# EAGLE design cafereg2 (EAGLE 9.6.1)

## Sheet 1 of 6: SiC431 1V 20A
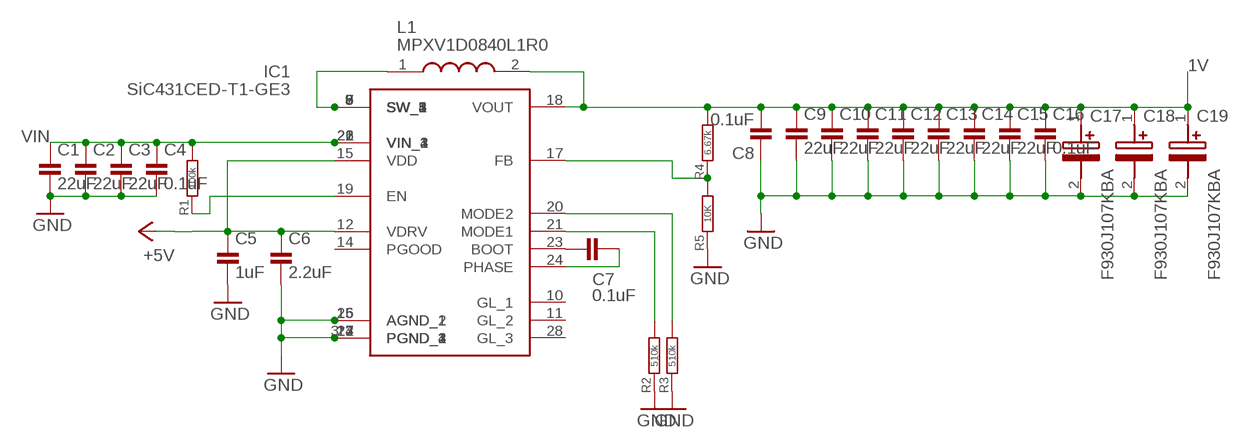
[diagram p0: schematic, sheet 1]

### Parts
C1  22uF  C-USC0603  [C0603]
C2  22uF  C-USC0603  [C0603]
C3  22uF  C-USC0603  [C0603]
C4  0.1uF  C-USC0402  [C0402]
C5  1uF  C-USC0402  [C0402]
C6  2.2uF  C-USC0402  [C0402]
C7  0.1uF  C-USC0402  [C0402]
C8  0.1uF  C-USC0402  [C0402]
C9  22uF  C-USC0603  [C0603]
C10  22uF  C-USC0603  [C0603]
C11  22uF  C-USC0603  [C0603]
C12  22uF  C-USC0603  [C0603]
C13  22uF  C-USC0603  [C0603]
C14  22uF  C-USC0603  [C0603]
C15  22uF  C-USC0603  [C0603]
C16  0.1uF  C-USC0402  [C0402]
C17  F930J107KBA  [CAPPM3528X210N]
C18  F930J107KBA  [CAPPM3528X210N]
C19  F930J107KBA  [CAPPM3528X210N]
IC1  SiC431CED-T1-GE3  SIC431AED-T1-GE3  [SIC431AEDT1GE3]
L1  MPXV1D0840L1R0  [INDPM8680X400N]
R1  100k  R-US_R0402  [R0402]
R2  510k  R-US_R0402  [R0402]
R3  510k  R-US_R0402  [R0402]
R4  6.67k  R-US_R0402  [R0402]
R5  10K  R-US_R0402  [R0402]

### Nets
1V: C8.2 C9.1 C10.1 C11.1 C12.1 C13.1 C14.1 C15.1 C16.1 C17.1(+) C18.1(+) C19.1(+) IC1.18(VOUT) L1.2 R4.2
+5V: C5.1 C6.1 IC1.12(VDRV) IC1.15(VDD) ; also sheet 2,6
BOOT: C7.1 IC1.23(BOOT)
FB: IC1.17(FB) R4.1 R5.2
GND: C1.2 C2.2 C3.2 C4.2 C5.2 C6.2 C8.1 C9.2 C10.2 C11.2 C12.2 C13.2 C14.2 C15.2 C16.2 C17.2(-) C18.2(-) C19.2(-) IC1.3(PGND_1) IC1.4(PGND_2) IC1.13(PGND_3) IC1.16(AGND_1) IC1.25(AGND_2) IC1.27(PGND_4) IC1.29(PGND_1) R2.1 R3.1 R5.1 ; also sheet 2,3,4,5,6
N$5: IC1.19(EN) R1.1
N$6: IC1.21(MODE1) R2.2
N$7: IC1.5(SW_1) IC1.6(SW_2) IC1.7(SW_3) IC1.8(SW_4) IC1.9(SW_5) L1.1
N$8: IC1.20(MODE2) R3.2
PHASE: C7.2 IC1.24(PHASE)
VIN: C1.1 C2.1 C3.1 C4.1 IC1.1(VIN_1) IC1.2(VIN_2) IC1.22(VIN_3) IC1.26(VIN_4) R1.2 ; also sheet 2,3,4,5,6
Unconnected: IC1.10(GL_1) IC1.11(GL_2) IC1.14(PGOOD) IC1.28(GL_3)

## Sheet 2 of 6: SiC438 1.15V 8A
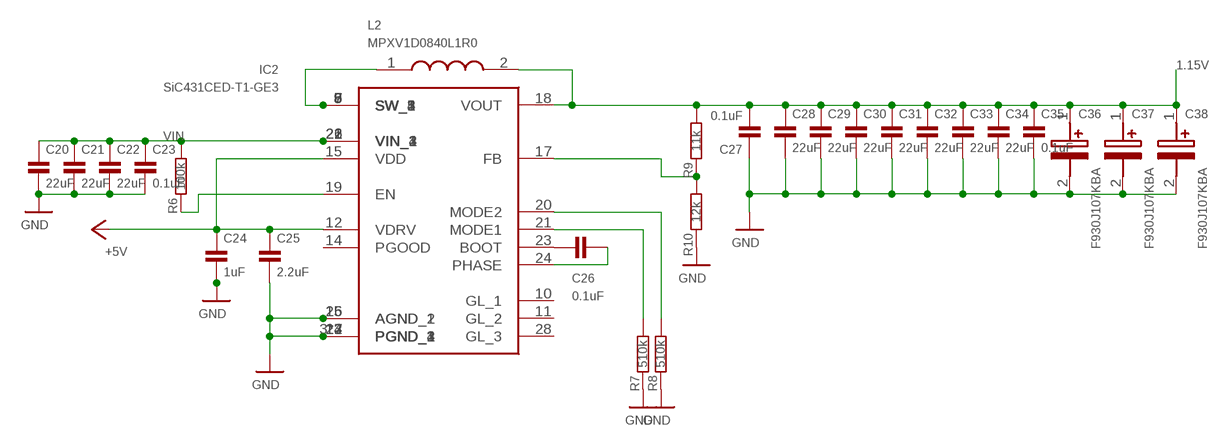
[diagram p1: schematic, sheet 2]

### Parts
C20  22uF  C-USC0603  [C0603]
C21  22uF  C-USC0603  [C0603]
C22  22uF  C-USC0603  [C0603]
C23  0.1uF  C-USC0402  [C0402]
C24  1uF  C-USC0402  [C0402]
C25  2.2uF  C-USC0402  [C0402]
C26  0.1uF  C-USC0402  [C0402]
C27  0.1uF  C-USC0402  [C0402]
C28  22uF  C-USC0603  [C0603]
C29  22uF  C-USC0603  [C0603]
C30  22uF  C-USC0603  [C0603]
C31  22uF  C-USC0603  [C0603]
C32  22uF  C-USC0603  [C0603]
C33  22uF  C-USC0603  [C0603]
C34  22uF  C-USC0603  [C0603]
C35  0.1uF  C-USC0402  [C0402]
C36  F930J107KBA  [CAPPM3528X210N]
C37  F930J107KBA  [CAPPM3528X210N]
C38  F930J107KBA  [CAPPM3528X210N]
IC2  SiC431CED-T1-GE3  SIC431AED-T1-GE3  [SIC431AEDT1GE3]
L2  MPXV1D0840L1R0  [INDPM8680X400N]
R6  100k  R-US_R0402  [R0402]
R7  510k  R-US_R0402  [R0402]
R8  510k  R-US_R0402  [R0402]
R9  11k  R-US_R0402  [R0402]
R10  12k  R-US_R0402  [R0402]

### Nets
1.15V: C27.2 C28.1 C29.1 C30.1 C31.1 C32.1 C33.1 C34.1 C35.1 C36.1(+) C37.1(+) C38.1(+) IC2.18(VOUT) L2.2 R9.2
+5V: C24.1 C25.1 IC2.12(VDRV) IC2.15(VDD) ; also sheet 1,6
BOOT2: C26.1 IC2.23(BOOT)
FB2: IC2.17(FB) R9.1 R10.2
GND: C20.2 C21.2 C22.2 C23.2 C24.2 C25.2 C27.1 C28.2 C29.2 C30.2 C31.2 C32.2 C33.2 C34.2 C35.2 C36.2(-) C37.2(-) C38.2(-) IC2.3(PGND_1) IC2.4(PGND_2) IC2.13(PGND_3) IC2.16(AGND_1) IC2.25(AGND_2) IC2.27(PGND_4) IC2.29(PGND_1) R7.1 R8.1 R10.1 ; also sheet 1,3,4,5,6
N$12: IC2.19(EN) R6.1
N$13: IC2.5(SW_1) IC2.6(SW_2) IC2.7(SW_3) IC2.8(SW_4) IC2.9(SW_5) L2.1
N$14: IC2.21(MODE1) R7.2
N$15: IC2.20(MODE2) R8.2
PHASE2: C26.2 IC2.24(PHASE)
VIN: C20.1 C21.1 C22.1 C23.1 IC2.1(VIN_1) IC2.2(VIN_2) IC2.22(VIN_3) IC2.26(VIN_4) R6.2 ; also sheet 1,3,4,5,6
Unconnected: IC2.10(GL_1) IC2.11(GL_2) IC2.14(PGOOD) IC2.28(GL_3)

## Sheet 3 of 6: TPS63810 3.3V 2.5A
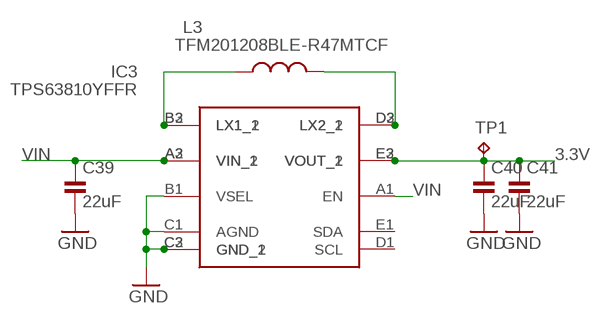
[diagram p2: schematic, sheet 3]

### Parts
C39  22uF  C-USC0603  [C0603]
C40  22uF  C-USC0603  [C0603]
C41  22uF  C-USC0603  [C0603]
IC3  TPS63810YFFR  [BGA15C40P3X5_134X226X62]
L3  TFM201208BLE-R47MTCF  L_CHIP-0805(2012-METRIC)  [INDC2009X120]
TP1  TPTP12SQ  [TP12SQ]

### Nets
3.3V: C40.1 C41.1 IC3.E2(VOUT_1) IC3.E3(VOUT_2) TP1.TP
GND: C39.2 C40.2 C41.2 IC3.B1(VSEL) IC3.C1(AGND) IC3.C2(GND_1) IC3.C3(GND_2) ; also sheet 1,2,4,5,6
SW1: IC3.B2(LX1_1) IC3.B3(LX1_2) L3.1
SW2: IC3.D2(LX2_1) IC3.D3(LX2_2) L3.2
VIN: C39.1 IC3.A1(EN) IC3.A2(VIN_1) IC3.A3(VIN_2) ; also sheet 1,2,4,5,6
Unconnected: IC3.D1(SCL) IC3.E1(SDA)

## Sheet 4 of 6: MUN3CAD03-SE 1.5V 3A
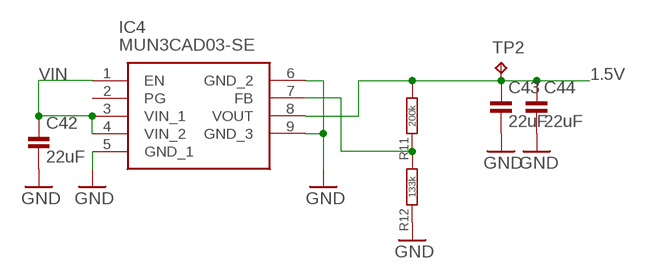
[diagram p3: schematic, sheet 4]

### Parts
C42  22uF  C-USC0603  [C0603]
C43  22uF  C-USC0603  [C0603]
C44  22uF  C-USC0603  [C0603]
IC4  MUN3CAD03-SE  [MUN3CAD03SE]
R11  200k  R-US_R0402  [R0402]
R12  133k  R-US_R0402  [R0402]
TP2  TPTP12SQ  [TP12SQ]

### Nets
1.5V: C43.1 C44.1 IC4.8(VOUT) R11.2 TP2.TP
FB1: IC4.7(FB) R11.1 R12.2
GND: C42.2 C43.2 C44.2 IC4.5(GND_1) IC4.6(GND_2) IC4.9(GND_3) R12.1 ; also sheet 1,2,3,5,6
VIN: C42.1 IC4.1(EN) IC4.3(VIN_1) IC4.4(VIN_2) ; also sheet 1,2,3,5,6
Unconnected: IC4.2(PG)

## Sheet 5 of 6: MUN3CAD01-SB 1.1/1.25V 1A
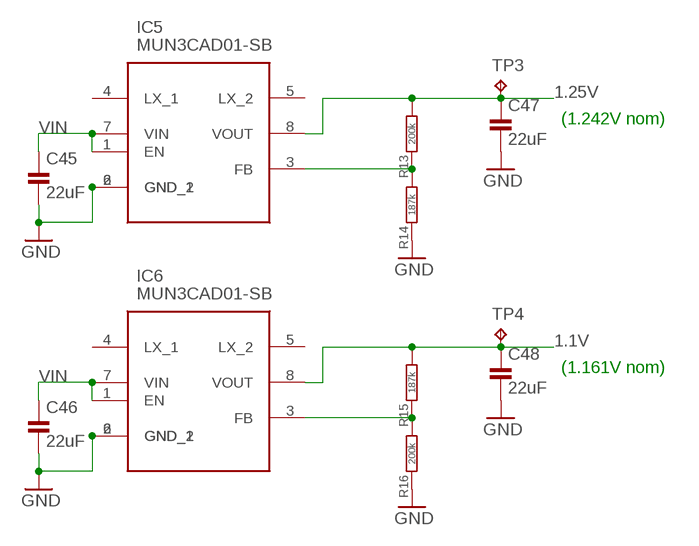
[diagram p4: schematic, sheet 5]

### Parts
C45  22uF  C-USC0603  [C0603]
C46  22uF  C-USC0603  [C0603]
C47  22uF  C-USC0603  [C0603]
C48  22uF  C-USC0603  [C0603]
IC5  MUN3CAD01-SB  [MUN3CAD01SB]
IC6  MUN3CAD01-SB  [MUN3CAD01SB]
R13  200k  R-US_R0402  [R0402]
R14  187k  R-US_R0402  [R0402]
R15  187k  R-US_R0402  [R0402]
R16  200k  R-US_R0402  [R0402]
TP3  TPTP12SQ  [TP12SQ]
TP4  TPTP12SQ  [TP12SQ]

### Nets
1.1V: C48.1 IC6.8(VOUT) R15.2 TP4.TP
1.25V: C47.1 IC5.8(VOUT) R13.2 TP3.TP
GND: C45.2 C46.2 C47.2 C48.2 IC5.2(GND_1) IC5.6(GND_2) IC6.2(GND_1) IC6.6(GND_2) R14.1 R16.1 ; also sheet 1,2,3,4,6
N$1: IC6.3(FB) R15.1 R16.2
N$2: IC5.3(FB) R13.1 R14.2
VIN: C45.1 C46.1 IC5.1(EN) IC5.7(VIN) IC6.1(EN) IC6.7(VIN) ; also sheet 1,2,3,4,6
Unconnected: IC5.4(LX_1) IC5.5(LX_2) IC6.4(LX_1) IC6.5(LX_2)

### Notes on the sheet
- (1.242V nom)
- (1.161V nom)

## Sheet 6 of 6: KTC2210 5V 1A
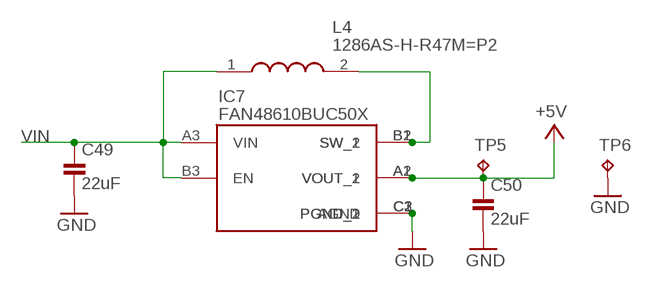
[diagram p5: schematic, sheet 6]

### Parts
C49  22uF  C-USC0603  [C0603]
C50  22uF  C-USC0603  [C0603]
IC7  FAN48610BUC50X  [BGA9C40P3X3_122X122X62]
L4  1286AS-H-R47M=P2  [1286ASH1R0MP2]
TP5  TPTP12SQ  [TP12SQ]
TP6  TPTP12SQ  [TP12SQ]

### Nets
+5V: C50.1 IC7.A1(VOUT_1) IC7.A2(VOUT_2) TP5.TP ; also sheet 1,2
GND: C49.2 C50.2 IC7.C1(PGND_1) IC7.C2(PGND_2) IC7.C3(AGND) TP6.TP ; also sheet 1,2,3,4,5
SW: IC7.B1(SW_1) IC7.B2(SW_2) L4.2
VIN: C49.1 IC7.A3(VIN) IC7.B3(EN) L4.1 ; also sheet 1,2,3,4,5

## Library data of the parts
C1-C16 C20-C35 C39-C50 = resistor:C-US: CAPACITOR, American symbol
C17-C19 C36-C38 = SamacSys_Parts:F930J107KBA: AVX 100uF 6.3 V Tantalum Capacitor Electrolytic Solid F93 Series Source: Datasheet <http://datasheets.avx.com/F93.pdf>; DESCRIPTION: AVX 100uF 6.3 V Tantalum Capacitor Electrolytic Solid F93 Series; HEIGHT: 2.1mm; MANUFACTURER_NAME: AVX; MANUFACTURER_PART_NUMBER: F930J107KBA; MOUSER_PART_NUMBER: 647-F930J107KBA; MOUSER_PRICE-STOCK: https://www.mouser.co.uk/ProductDetail/AVX/F930J107KBA/?qs=a5AWWN0nKwZJCzViS%2FKXGw%3D%3D
IC1 IC2 = personal:SIC431AED-T1-GE3: Switching Voltage Regulators 4.5-24V 24A 50uA microBUCK MLP44-24 Source: Datasheet; DESCRIPTION: Switching Voltage Regulators 4.5-24V 24A 50uA microBUCK MLP44-24; HEIGHT: mm; MANUFACTURER_NAME: Vishay; MANUFACTURER_PART_NUMBER: SiC431AED-T1-GE3; MOUSER_PART_NUMBER: 78-SIC431AED-T1-GE3; MOUSER_PRICE-STOCK: https://www.mouser.co.uk/ProductDetail/Vishay-Siliconix/SIC431AED-T1-GE3?qs=chTDxNqvsynTWHIPRmLWxw%3D%3D
IC3 = SamacSys_Parts:TPS63810YFFR: Switching Voltage Regulators 2.5-A high-efficient buck-boost converter with interface for dynamic voltage scaling 15-DSBGA -40 to 85 Source: Datasheet <http://www.ti.com/lit/ds/symlink/tps63810.pdf>; DESCRIPTION: Switching Voltage Regulators 2.5-A high-efficient buck-boost converter with interface for dynamic voltage scaling 15-DSBGA -40 to 85; HEIGHT: 0.625mm; MANUFACTURER_NAME: Texas Instruments; MANUFACTURER_PART_NUMBER: TPS63810YFFR; MOUSER_PART_NUMBER: 595-TPS63810YFFR; MOUSER_PRICE-STOCK: https://www.mouser.co.uk/ProductDetail/Texas-Instruments/TPS63810YFFR?qs=B6kkDfuK7%2FBxO%252BN9P7Asyw%3D%3D
IC4 = SamacSys_Parts:MUN3CAD03-SE: Non-Isolated DC/DC Converters 3A 5Vin inductor-integrated DC-DC converters Source: Datasheet; DESCRIPTION: Non-Isolated DC/DC Converters 3A 5Vin inductor-integrated DC-DC converters; HEIGHT: 1.3mm; MANUFACTURER_NAME: Delta Electronics; MANUFACTURER_PART_NUMBER: MUN3CAD03-SE; MOUSER_PART_NUMBER: 108-MUN3CAD03-SE; MOUSER_PRICE-STOCK: https://www.mouser.co.uk/ProductDetail/Delta-Electronics/MUN3CAD03-SE?qs=t7xnP681wgWoX6LfHO%2FvWw%3D%3D
IC5 IC6 = SamacSys_Parts:MUN3CAD01-SB: 1.0A Output Current 92% Peak Efficiency at 3.3VIN Input Voltage Range from 2.5V to 5.5V Output Voltage Range from 0.8V to 4.0V(2.5mm 2.0mm x 1.1mm(max)) Enable Function Source: Datasheet <https://www.cyntec.com/upfile/products/download/Cyntec MUN3CAD01-SB_Datasheet 06.pdf>; DESCRIPTION: 1.0A Output Current 92% Peak Efficiency at 3.3VIN Input Voltage Range from 2.5V to 5.5V Output Voltage Range from 0.8V to 4.0V(2.5mm 2.0mm x 1.1mm(max)) Enable Function; HEIGHT: 1.1mm; MANUFACTURER_NAME: Cyntec; MANUFACTURER_PART_NUMBER: MUN3CAD01-SB
IC7 = SamacSys_Parts:FAN48610BUC50X: Fairchild Semiconductor FAN48610BUC50X, Boost Converter, Synchronous Boost Regulator 1000mA Maximum of 5 V, 3 MHz Source: Datasheet <https://datasheet.datasheetarchive.com/originals/distributors/Datasheets_SAMA/df3e85b90ab3bcbb613a20fbddbf2a27.pdf>; DESCRIPTION: Fairchild Semiconductor FAN48610BUC50X, Boost Converter, Synchronous Boost Regulator 1000mA Maximum of 5 V, 3 MHz; HEIGHT: 0.619mm; MANUFACTURER_NAME: onsemi; MANUFACTURER_PART_NUMBER: FAN48610BUC50X; MOUSER_PART_NUMBER: 512-FAN48610BUC50X; MOUSER_PRICE-STOCK: https://www.mouser.co.uk/ProductDetail/onsemi-Fairchild/FAN48610BUC50X?qs=3SGS%2FGl3GGxq8QpgJZs7Nw%3D%3D
L1 L2 = SamacSys_Parts:MPXV1D0840L1R0: KEMET, MPXV, Power, 1 uH, 20%, 155C, -55C, 0840(3431), 20.8 A, 4.2 mOhms, 40 MHz, 1000, 8.65mm, 8.9mm, 8mm, 8.2mm, 4mm, 4mm Source: Datasheet <https://content.kemet.com/datasheets/KEM_L9013_MPXV.pdf>; DESCRIPTION: KEMET, MPXV, Power, 1 uH, 20%, 155C, -55C, 0840(3431), 20.8 A, 4.2 mOhms, 40 MHz, 1000, 8.65mm, 8.9mm, 8mm, 8.2mm, 4mm, 4mm; HEIGHT: 4mm; MANUFACTURER_NAME: KEMET; MANUFACTURER_PART_NUMBER: MPXV1D0840L1R0
L3 = Inductor:L: Inductor Fixed - Generic; CATEGORY: Inductor; SUB-CATEGORY: Fixed
L4 = SamacSys_Parts:1286AS-H-R47M=P2: Toko DFE201612C Series Shielded Wire-wound SMD Inductor with a Powered Iron Core, 470 nH Wire-Wound 4.2A Idc Source: Datasheet <https://psearch.en.murata.com/inductor/product/1286AS-H-R47M#.html>; DESCRIPTION: Toko DFE201612C Series Shielded Wire-wound SMD Inductor with a Powered Iron Core, 470 nH Wire-Wound 4.2A Idc; HEIGHT: 1.2mm; MANUFACTURER_NAME: Murata Electronics; MANUFACTURER_PART_NUMBER: 1286AS-H-R47M=P2; MOUSER_PART_NUMBER: 81-1286AS-H-R47MP2; MOUSER_PRICE-STOCK: https://www.mouser.co.uk/ProductDetail/Murata-Electronics/1286AS-H-R47M%3dP2?qs=KuGPmAKtFKWcPKeH5oNBbA%3D%3D
R1-R16 = resistor:R-US_: RESISTOR, American symbol
TP1-TP6 = testpad:TP: Test pad

## Board
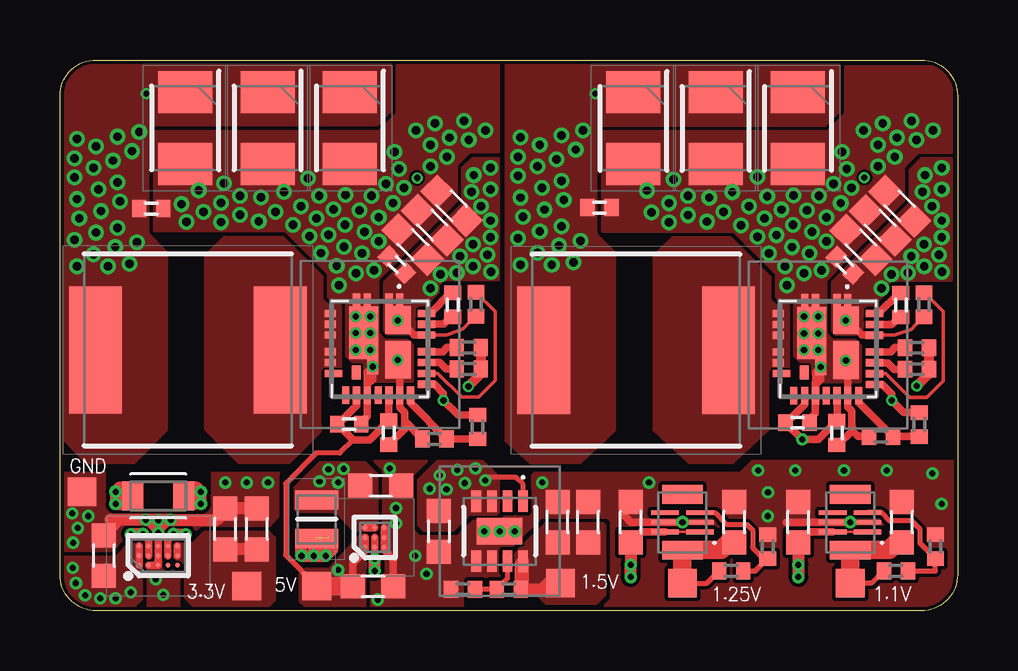
[diagram p6: board, top side]
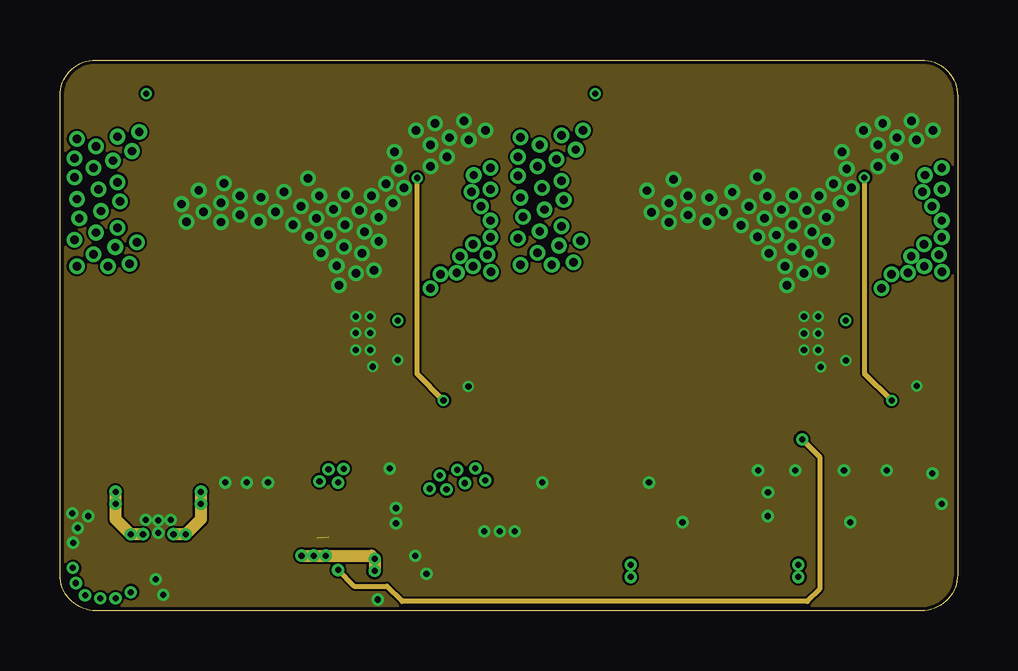
[diagram p7: board, inner layer Route2]
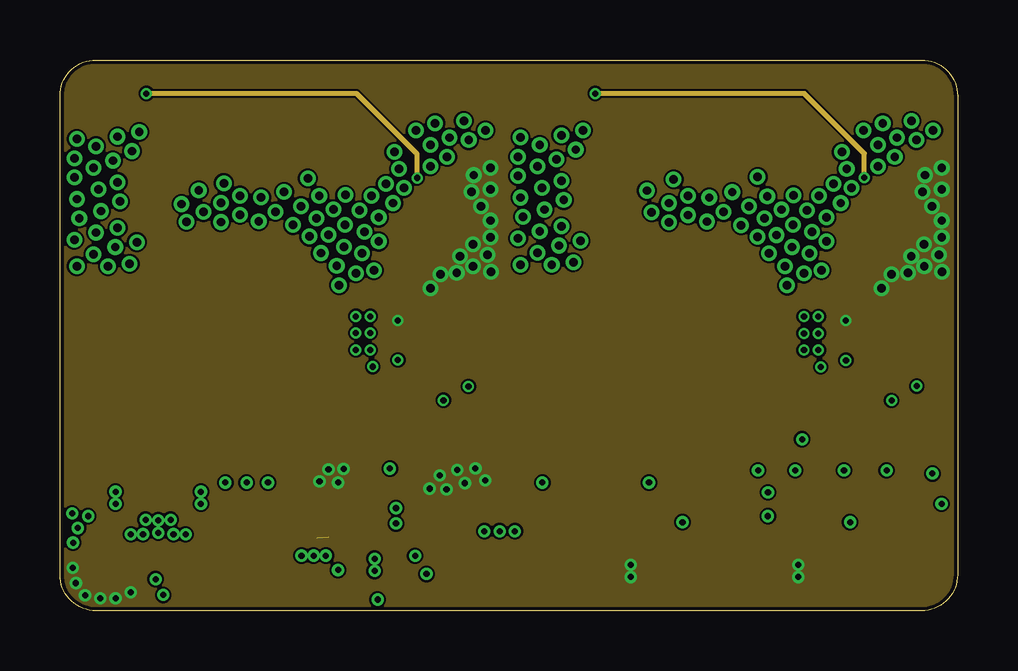
[diagram p8: board, inner layer Route15]
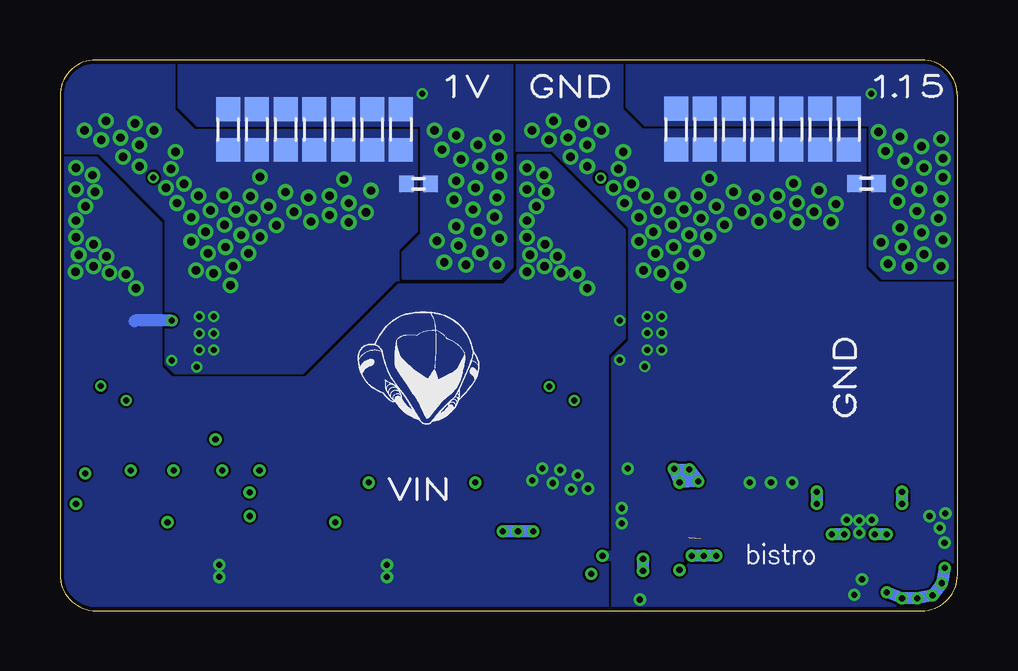
[diagram p9: board, bottom side, seen from below]

Size 37.4 x 22.96 mm. Coordinates in mm from the lower left corner, seen from the top.
Outline: 1.5,22.96 35.9,22.96 arc-90 37.4,21.46 37.4,1.5 arc-90 35.9,0 1.5,0 arc-90 0,1.5 0,21.46 arc-90 1.5,22.96
Copper layers (1+2*15+16): Top 0.035mm / dielectric 0.2mm / Route2 0.035mm / dielectric 0.26mm / Route15 0.035mm / dielectric 0.2mm / Bottom 0.035mm
Design rules "default *": minimum track width 5mil, minimum drill 10mil, track to track 3.5mil, track to pad 3.5mil, pad to pad 3.5mil, via to via 3.5mil, smd to smd 0mil, copper to edge 6mil, drill to drill 6mil, minimum pad ring 4mil, minimum via ring 4mil, stop-mask expansion 1mil, vias tented up to drill 200mil, thermal gap 10mil
tRestrict: area 3.5,4.2 to 4.7,5.9; 9 lines

### Footprints (pad centres in the part's own frame; a part is rotated, then mirrored left to right if it is on the bottom)
C0603 = smd 1 x 1: 1 -0.85,0; 2 0.85,0
C0402 = smd 0.6 x 0.7: 1 -0.5,0; 2 0.5,0
CAPPM3528X210N = smd 1.75 x 2.25: 1 -1.5,0; 2 1.5,0
SIC431AEDT1GE3 = smd 0.55 x 0.3: 1 -0.825,0.075; 2 -0.825,-0.375; 3 -0.825,-1.275; 4 -0.825,-1.725 | smd 0.3 x 0.45: 5 -0.275,-2.825; 6 0.175,-2.825; 7 0.625,-2.825; 8 1.325,-2.825; 9 1.775,-2.825 | smd 0.3 x 0.73: 10 2.225,-2.685; 18 2.678,1.187; 19 2.228,1.187; 20 1.777,1.187; 21 1.328,1.187; 22 0.627,1.187; 23 0.177,1.187; 24 -0.273,1.187 | smd 0.73 x 0.3: 11 3.14,-2.175; 12 3.14,-1.725; 13 3.14,-1.275; 14 3.14,-0.825; 15 3.14,-0.375; 16 3.14,0.075; 17 3.14,0.525 | smd 1.575 x 1.05: 25 1.662,0 | smd 1.15 x 1.05: 26 0,0 | smd 2.175 x 1.2: 27 0.537,-1.425 | smd 0.58 x 0.38: 28 2.185,-1.74 | smd 0.65 x 0.455: 29 1.95,-1.052
BGA15C40P3X5_134X226X62 = smd 0.2 x 0.2: A1 -0.4,0.8; A2 0,0.8; A3 0.4,0.8; B1 -0.4,0.4; B2 0,0.4; B3 0.4,0.4; C1 -0.4,0; C2 0,0; C3 0.4,0; D1 -0.4,-0.4; D2 0,-0.4; D3 0.4,-0.4; E1 -0.4,-0.8; E2 0,-0.8; E3 0.4,-0.8
MUN3CAD03SE = smd 0.9 x 0.4: 1 -1.25,0.975; 2 -1.25,0.325; 3 -1.25,-0.325; 4 -1.25,-0.975; 5 1.25,-0.975; 6 1.25,-0.325; 7 1.25,0.325; 8 1.25,0.975 | smd 1.1 x 1.9: 9 0,0
MUN3CAD01SB = smd 1.15 x 0.2: 1 -0.725,0.4; 2 -0.725,0; 3 -0.725,-0.4; 5 0.725,-0.4; 6 0.725,0; 7 0.725,0.4 | smd 1.7 x 0.78: 4 0,-1.16; 8 0,1.16
BGA9C40P3X3_122X122X62 = smd 0.208 x 0.208: A1 -0.4,0.4; A2 0,0.4; A3 0.4,0.4; B1 -0.4,0; B2 0,0; B3 0.4,0; C1 -0.4,-0.4; C2 0,-0.4; C3 0.4,-0.4
INDPM8680X400N = smd 2.2 x 5.3: 1 -3.85,0; 2 3.85,0
INDC2009X120 = smd 0.876 x 1.21: 1 -1.067,0; 2 1.067,0
1286ASH1R0MP2 = smd 0.8 x 1.8: 1 -0.8,0; 2 0.8,0
R0402 = smd 0.6 x 0.7: 1 -0.5,0; 2 0.5,0
TP12SQ = smd 1.2 x 1.2: TP 0,0

### Placement (x,y rotation side)
C1  34.99,16.88 135 top
C2  34.18,16.07 135 top
C3  33.37,15.26 135 top
C4  32.7,14.42 135 top
C5  32.37,7.41 270 top
C6  30.73,7.84 0 top
C7  35.04,12.75 90 top
C8  22.47,17.8 0 bottom
C9  24.4,20.07 270 bottom
C10  23.2,20.07 270 bottom
C11  25.6,20.07 270 bottom
C12  26.8,20.07 270 bottom
C13  28,20.07 270 bottom
C14  29.2,20.07 270 bottom
C15  30.4,20.07 270 bottom
C16  22.48,16.8 0 top
C17  23.89,20.11 270 top
C18  27.32,20.11 270 top
C19  30.75,20.11 270 top
C20  16.32,16.89 135 top
C21  15.51,16.08 135 top
C22  14.7,15.27 135 top
C23  14.03,14.43 135 top
C24  13.7,7.42 270 top
C25  12.05,7.78 0 top
C26  16.37,12.76 90 top
C27  3.8,17.81 0 bottom
C28  5.73,20.08 270 bottom
C29  4.53,20.08 270 bottom
C30  6.93,20.08 270 bottom
C31  8.13,20.08 270 bottom
C32  9.33,20.08 270 bottom
C33  10.53,20.08 270 bottom
C34  11.73,20.08 270 bottom
C35  3.8,16.77 0 top
C36  5.22,20.12 270 top
C37  8.65,20.12 270 top
C38  12.08,20.12 270 top
C39  1.83,2.29 90 top
C40  6.89,3.41 90 top
C41  8.21,3.41 90 top
C42  15.78,3.31 270 top
C43  22,3.69 90 top
C44  20.73,3.69 90 top
C45  23.78,3.69 90 top
C46  30.76,3.69 90 top
C47  28.1,3.69 90 top
C48  35.08,3.69 90 top
C49  13.36,5.22 0 top
C50  13.04,1.02 0 top
IC1  32.75,12.11 270 top
IC2  14.08,12.12 270 top
IC3  4.09,2.29 90 top
IC4  18.32,3.31 270 top
IC5  25.94,3.69 180 top
IC6  32.92,3.69 180 top
IC7  13.11,3.06 90 top
L1  24,10.87 180 top
L2  5.33,10.88 180 top
L3  4.09,4.78 0 top
L4  10.7,3.82 270 top
R1  36,12.76 270 top
R2  35.7,10.96 180 top
R3  35.7,10.06 180 top
R4  35.8,7.77 90 top
R5  34.2,7.27 0 top
R6  17.33,12.78 270 top
R7  17.03,10.97 180 top
R8  17.03,10.07 180 top
R9  17.4,7.66 90 top
R10  15.6,7.17 0 top
R11  18.7,0.9 0 top
R12  16.79,0.9 0 top
R13  27.97,1.66 180 top
R14  29.49,2.68 270 top
R15  34.83,1.66 180 top
R16  36.48,2.68 270 top
TP1  7.78,1.02 0 top
TP2  20.86,1.15 0 top
TP3  25.94,1.15 0 top
TP4  32.92,1.15 0 top
TP5  10.7,1.02 90 top
TP6  0.92,4.96 0 top

### Tracks (layer width: path | path; a pad name or v marks a point on that pad's centre or on a via)
1.1V
  Top 0.203: TP4.TP 33.81,1.15 R15.2
  Top 0.762: TP4.TP IC6.8 34.55,2.53 34.87,2.84 C48.1
1.5V
  Top 0.508: R11.2 20.09,0.9 20.35,1.15 | R11.2 19.29,0.99 IC4.8 19.2,1.97 R11.2
  pour Top (no thermals): 18.95,1.91 18.95,2.42 19.21,2.68 20.22,3.69 21.24,3.69 22.64,3.69 22.76,3.56 22.76,0.64 22.38,0.26 20.22,0.26 19.84,0.64 18.95,1.53
1.15V  (via drill 0.25 pad 0.4, 0.35 pad 0.65)
  Top 0.305: IC2.18 15.59,9.45 15.98,9.06 v15.98,8.78 16.59,8.16 R9.2
  Route2 0.203: v14.88,18.05 14.88,9.88 v15.98,8.78
  Route15 0.203: v3.6,21.57 12.36,21.57 14.88,19.05 v14.88,18.05
  other vias: 0.7,14.37 1.4,14.87 2,14.37 2.3,15.16 2.9,14.46 3.2,15.37 0.6,15.46 1.5,15.76 2.4,15.96 0.8,16.37 0.7,17.16 1.7,16.66 2.5,17.07 1.6,17.57 0.6,18.07 2.4,17.87 1.4,18.46 0.6,18.87 2.2,18.77 3,19.16 3.3,19.96 2.4,19.77 1.5,19.37 0.7,19.68
  pour Top (no thermals): 0.23,22.78 0.23,7.08 1.1,6.19 3.1,6.19 4.43,7.54 4.43,14.93 3.65,15.71 3.65,20.27 13.19,20.27 13.77,20.85 13.77,22.78
  pour Bottom (no thermals): 0.23,22.78 0.23,13.88 3.15,13.88 3.65,14.38 3.65,20.27 13.02,20.27 13.77,21.02 13.77,22.78
1.25V
  Top 0.203: TP3.TP 26.95,1.15 27.46,1.66 R13.2
  Top 0.762: TP3.TP IC5.8 27.56,2.53 27.87,2.84 C47.1
1V  (via drill 0.25 pad 0.4, 0.35 pad 0.65)
  Top 0.305: IC1.18 34.26,9.44 34.65,9.05 v34.65,8.77 35.15,8.27 R4.2
  Route2 0.203: v33.52,18.07 33.52,9.89 v34.65,8.77
  Route15 0.203: v33.52,18.07 33.52,19.07 31.02,21.57 v22.3,21.57
  other vias: 19.19,14.42 19.89,14.92 20.49,14.42 20.79,15.22 21.39,14.53 21.69,15.42 19.09,15.53 19.99,15.82 20.89,16.03 19.29,16.43 19.19,17.23 20.19,16.73 20.99,17.12 20.09,17.62 19.09,18.12 20.89,17.93 19.89,18.53 19.09,18.93 20.69,18.82 21.49,19.23 21.79,20.03 20.89,19.83 19.99,19.43 19.19,19.74
  pour Top (no thermals): 19.6,6.19 21.67,6.19 23.1,7.51 23.1,14.92 22.32,15.71 22.32,20.26 31.86,20.26 32.44,20.84 32.44,22.77 18.6,22.77 18.6,7.08
  pour Bottom (no thermals): 18.58,22.77 18.58,14.32 19.04,13.87 23.1,13.87 23.1,14.92 22.32,15.71 22.32,20.26 31.69,20.26 32.44,21.01 32.44,22.77
3.3V
  Top 0.305: IC3.E2 IC3.E3
  Top 0.508: C41.1 C40.1
  pour Top (no thermals): 4.73,2.2 4.73,2.78 4.8,2.85 5.54,2.85 6.01,3.32 8.72,3.32 8.99,3.05 8.99,0.43 8.72,0.16 5.52,0.16 5.17,0.51 5.17,1.91 4.99,2.09 4.84,2.09
+5V  (via drill 0.25 pad 0.51)
  Top 0.127: v30.92,7.15 v30.92,7.14 | 12.21,7.12 12.21,7.09
  Top 0.203: C50.1 11.59,1.63 v11.59,1.7 | 12.21,7.12 11.66,6.57 10.67,6.57 9.4,5.29 9.4,2.33 TP5.TP
  Top 0.305: IC2.15 C24.1 | 11.71,7.78 C25.1 | IC2.12 12.36,8.55 11.59,7.78 C25.1 | IC1.15 C5.1 | IC1.12 31.03,8.6 30.27,7.84 C6.1 v30.92,7.15 31.6,7.15 C5.1 | C25.1 12.21,7.12 12.9,7.12 C24.1 | IC7.A2 IC7.A1 12.71,2.5 12.19,1.98 C50.1
  Top 0.406: C24.1 | C5.1
  Top 0.762: C50.1 TP5.TP
  Route2 0.203: v30.92,7.14 31.65,6.41 31.65,0.9 31.14,0.39 14.25,0.39 13.62,1.02 12.26,1.02 v11.59,1.7
  pour Top (no thermals): 11.21,1.79 12.46,3.17 arc-48 12.56,3.21 12.71,3.21 arc-90 12.86,3.06 12.86,2.5 arc-45 12.82,2.39 arc45 12.76,2.24 12.76,0.15 10.18,0.15 9.96,0.37 9.96,1.53 10.21,1.79
BOOT
  Top 0.305: IC1.23 34.66,11.94 34.98,12.25 C7.1
BOOT2
  Top 0.305: IC2.23 16,11.95 16.31,12.26 C26.1
FB
  Top 0.203: 33.28,8.79 IC1.17
  Top 0.305: IC1.17 33.28,8.87 | R4.1 34.88,7.27 34.7,7.45 R5.2 33.28,8.69 33.28,8.79
FB1
  Top 0.203: IC4.7 18.64,1.34 R11.1 R12.2
FB2
  Top 0.203: IC2.17 14.61,8.8
  Top 0.305: R9.1 R10.2 14.61,8.66 IC2.17
GND  (via drill 0.25 pad 0.4, 0.25 pad 0.51, 0.35 pad 0.65)
  Top 0.305: 33,7.67 33,8.33 32.83,8.5 IC1.16 32.83,10.36 v32.75,10.44 | 33,7.67 33,7.66 33,7.5 32.41,6.91 C5.2 | R5.1 33.26,7.27 33,7.53 33,7.67 | IC1.13 31.48,8.22 31.23,7.97 C6.2 | IC1.13 31.48,9.52 31.48,9.95 IC1.29 | IC1.13 31.48,9.41 31.7,9.64 IC1.29 | IC2.13 12.81,8.11 12.66,7.96 12.66,7.89 C25.2 12.57,7.78 | IC2.13 12.81,9.53 12.81,9.96 IC2.29 | IC2.13 12.81,9.42 13.03,9.65 IC2.29 | v14.08,10.45 14.16,10.37 IC2.16 14.16,8.48 14.36,8.28 14.36,7.9 | C24.2 14.36,7.58 14.36,7.9 | R10.1 14.36,7.9 | IC3.B1 IC3.C1 IC3.C2 IC3.C3 v4.09,3.25 | IC7.C3 IC7.C2 IC7.C1 13.51,2.53 13.89,2.15 C50.2 | 30.25,3.69 IC6.6 v32.92,3.69 | 23.52,3.95 23.78,3.69 IC5.6 v25.94,3.69 | v18.95,3.31 IC4.9 v17.68,3.31
  Top 0.406: R2.1 R3.1 36.2,9.87 v35.7,9.37 | R7.1 R8.1 17.53,9.87 v17.02,9.36
  Top 0.508: 3.7,3.79 4.09,3.4 v4.09,3.25 4.09,3.41 4.48,3.79 | 4.48,3.79 2.44,3.79 | 2.44,3.79 2.11,3.79 | 4.48,3.79 6.55,3.79 6.89,4.12 C40.2 C41.2 | 2.44,3.79 1.83,3.18 C39.2
  Bottom 0.508: v17.68,3.31 v18.95,3.31
  other vias: 29.36,16.36 28.71,16.86 29.47,17.29 28.38,16.07 29.06,15.59 29.85,15.66 29.54,14.9 30.2,14.37 30.5,15.16 30.55,16.09 30.07,16.73 30.56,17.32 31,14.06 30.3,13.56 28.01,17.46 27.65,16.62 26.95,16.23 27.05,17.23 26.17,17.3 26.17,16.5 25.37,16.2 25.37,17 24.45,17.52 24.65,16.62 31.7,10.16 31,12.26 31.6,12.26 31,11.56 31.6,11.56 31,10.87 31.6,10.87 13.03,10.18 10.69,16.37 10.04,16.87 10.8,17.3 9.71,16.09 10.39,15.6 11.18,15.67 10.87,14.91 11.53,14.38 11.83,15.17 11.88,16.09 11.4,16.73 11.89,17.34 12.33,14.07 11.63,13.57 9.34,17.46 8.98,16.64 8.28,16.23 8.38,17.23 7.5,17.3 7.5,16.5 6.7,16.21 6.7,17 5.78,17.53 5.06,16.96 5.98,16.62 5.27,16.21 12.33,12.28 12.93,12.28 12.33,11.57 12.93,11.57 12.33,10.88 12.93,10.88 12.48,16.7 12.98,17.3 12.68,15.79 12.58,14.89 13.08,14.2 13.28,15.39 13.28,16.39 13.88,17 13.58,17.8 14.33,17.62 14.13,18.43 13.93,19.12 10.33,18.03 6.83,17.82 14.83,20.03 15.43,19.43 15.43,18.53 16.13,18.93 16.23,19.73 17.03,19.62 17.73,20.03 16.83,20.43 15.63,20.33 31.13,16.7 31.63,17.3 31.33,15.79 31.23,14.89 31.73,14.2 31.93,15.39 31.93,16.39 32.53,17 32.23,17.8 32.98,17.62 32.78,18.43 32.58,19.12 33.48,20.03 34.08,19.43 34.08,18.53 34.78,18.93 34.88,19.73 35.68,19.62 36.38,20.03 35.48,20.43 34.28,20.33 29.07,18.09 25.57,17.98 4.09,3.77 3.57,3.79 4.61,3.79 18.32,3.31 4.3,0.66 14,4.28 14,3.64 13.24,0.47 13.75,5.93 29.49,3.95 29.5,4.93 30.64,5.85 32.67,5.85 34.45,5.85 36.35,5.72 36.73,4.45 24.54,5.34 20.09,5.34 15.27,1.53 14.8,2.29 6.89,5.34 7.78,5.34 8.67,5.34 0.54,2.84 1.17,3.95 0.51,4.06 0.74,3.45 3.98,1.31 29.09,5.85
  pour Top (no thermals): 33.34,9.56 33.34,11.07 33.14,11.27 32.2,11.27 31.9,11.56 31.9,13.79 35.14,17.1 35.14,18.5 35.76,19.12 37.14,19.12 37.14,22.67 32.73,22.67 32.73,20.73 31.98,19.98 22.62,19.98 22.62,15.83 28.08,15.83 29.86,14.05 29.86,13.07 29.95,12.98 30.45,12.98 30.62,12.81 30.62,10.62 31.67,9.56
  pour Top (no thermals): 14.67,9.57 14.67,11.08 14.47,11.28 13.53,11.28 13.23,11.57 13.23,13.8 16.51,17.07 16.51,18.57 17.08,19.14 18.27,19.14 18.27,22.78 14.06,22.78 14.06,20.74 13.31,19.99 3.95,19.99 3.95,15.84 9.41,15.84 11.19,14.06 11.19,13.08 11.28,12.99 11.78,12.99 11.95,12.82 11.95,10.62 13,9.57
  pour Bottom (rank 3, no thermals): 37.4,-1.64 0,-1.64 0,22.96 37.4,22.96
  pour Route2 (rank 3, no thermals): 37.4,-1.64 0,-1.64 0,22.96 37.4,22.96
  pour Top (isolate 0.152, rank 2, no thermals): -0.61,5.72 9.81,5.72 10.32,6.23 18.83,6.23 19.33,5.72 28.35,5.72 28.86,6.23 37.49,6.23 37.49,-1.64 -0.61,-1.64
N$1
  Top 0.203: R15.1 36.48,1.66 R16.2 35.84,2.82 35.84,3.39 35.48,3.75 34.58,3.75 34.24,4.09 IC6.3
N$2
  Top 0.203: R13.1 28.98,1.66 R14.2 29.3,2.18 28.86,2.62 28.86,3.36 28.62,3.59 27.77,3.59 27.27,4.09 IC5.3
N$5
  Top 0.152: IC1.19 34.41,9.88 35.4,8.89 36.11,8.89 36.8,9.58 36.8,12.46 R1.1
N$6
  Top 0.305: IC1.21 34.61,10.79 34.79,10.96 R2.2
N$7
  pour Top (no thermals): 26.21,6.19 28.03,6.19 29.5,7.55 29.5,10.08 30.34,10.08 30.34,12.7 29.84,12.7 29.58,12.96 29.58,13.92 27.95,15.54 25.51,15.54 24.75,14.78 24.75,7.54
N$8
  Top 0.305: IC1.20 34.49,10.34 34.76,10.06 R3.2
N$12
  Top 0.152: IC2.19 15.74,9.89 16.73,8.9 17.44,8.9 18.13,9.6 18.13,12.47 R6.1
N$13
  pour Top (no thermals): 7.44,6.19 9.56,6.19 10.83,7.46 10.83,10.09 11.67,10.09 11.67,12.71 11.17,12.71 10.91,12.97 10.91,13.93 9.28,15.55 6.84,15.55 6.08,14.79 6.08,7.55
N$14
  Top 0.305: IC2.21 15.94,10.79 16.12,10.97 R7.2
N$15
  Top 0.305: IC2.20 15.82,10.35 16.09,10.07 R8.2
PHASE
  Top 0.305: IC1.24 34.1,12.39 34.96,13.25 C7.2
PHASE2
  Top 0.305: IC2.24 15.43,12.4 16.29,13.26 C26.2
SW  (via drill 0.25 pad 0.51)  (1 unrouted)
  Top 0.305: IC7.B2 IC7.B1 v13.11,2.17
  Top 0.508: v13.11,1.66 v13.11,2.17 | L4.2 10.7,2.93 | v10.57,2.29 v10.06,2.29 10.06,2.93 10.19,3.06 10.57,2.68 v10.57,2.29 | v10.57,2.29 v11.08,2.29 | v11.08,2.29 11.08,2.93 11.21,3.06 | v11.08,2.29 11.35,2.56 11.35,3.09
  Route2 0.508: v10.06,2.29 v11.08,2.29 12.98,2.29 v13.11,2.17 v13.11,1.66
  Bottom 0.508: v13.11,2.17 v13.11,1.66 | v10.06,2.29 v11.08,2.29
SW1  (via drill 0.25 pad 0.51)
  Top 0.305: IC3.B2 IC3.B3 3.69,2.95 3.46,3.18 v3.46,3.19
  Top 0.508: v3.46,3.19 v2.96,3.19 v2.95,3.18 | v2.32,4.45 v2.32,4.96 2.49,5.13 3.11,5.13 | v2.32,4.45 2.7,4.45 L3.1 2.65,4.78 v2.32,4.45
  Route2 0.508: v3.46,3.19 3.45,3.18 v2.95,3.18 2.32,3.82 v2.32,4.96
  Bottom 0.508: v2.95,3.18 v2.96,3.19 v3.46,3.19 | v2.32,4.45 v2.32,4.96
SW2  (via drill 0.25 pad 0.51)
  Top 0.305: IC3.D2 IC3.D3 4.49,2.95 4.73,3.18 v4.73,3.19
  Top 0.406: v5.23,3.19 v5.24,3.18
  Top 0.508: v4.73,3.19 v5.23,3.19 | v5.87,4.96 v5.87,4.45 5.49,4.45 L3.2 5.69,4.78 v5.87,4.96 | v5.87,4.96 5.7,5.14 5.1,5.14
  Route2 0.508: v5.87,4.96 v5.87,4.45 5.87,3.82 v5.24,3.18 4.73,3.18 v4.73,3.19
  Bottom 0.508: v4.73,3.19 v5.23,3.19 v5.24,3.18 | v5.87,4.96 v5.87,4.45
VIN  (via drill 0.25 pad 0.4, 0.25 pad 0.51, 0.35 pad 0.65)
  Top 0.102: IC6.7 IC6.1 | IC5.7 IC5.1
  Top 0.127: 35.95,12.26 R1.2 | 17.28,12.28 R6.2
  Top 0.152: IC1.22 34.78,11.49 35.46,11.73 35.95,12.26 | 36,12.16 R1.2 | IC2.22 16.11,11.5 16.79,11.74 17.28,12.28 | 17.33,12.17 R6.2
  Top 0.203: IC4.1 19.29,5.26 18.98,5.57 17.62,5.57
  Top 0.305: IC1.22 33.43,11.49 32.8,12.11 IC1.26 | IC2.22 14.76,11.5 14.13,12.12 IC2.26 | IC3.A1 IC3.A3 | IC7.A3 IC7.B3 | 24.54,3.29 IC5.7 24.23,3.29 C45.1 23.89,2.95 | C46.1 31.21,3.29 IC6.7
  Top 0.406: 23.96,2.95 23.89,2.95 | C46.1 30.83,2.84
  Top 0.508: C45.1 v23.78,1.91 v23.78,1.41 | C46.1 v30.76,1.91 v30.76,1.41
  Bottom 0.508: v32.74,12.09 34.27,12.09 34.3,12.06 | v0.54,1.79 v0.66,1.15 v1.04,0.64 v1.68,0.52 v2.32,0.52 v2.95,0.77 | v10.81,5.4 v11.19,5.89 v11.82,5.92 | v10.81,5.4 v11.59,5.34 v11.82,5.92 | v10.81,5.4 v11.82,5.92
  other vias: 15.85,14.04 15.43,13.45 17.21,14.37 16.67,14.78 16.53,14.09 17.2,15.29 17.94,15.56 17.82,14.84 17.95,14.12 17.94,16.27 17.54,16.87 17.94,17.57 17.14,17.46 17.24,18.16 17.94,18.46 34.65,14.04 34.23,13.45 36.01,14.37 35.47,14.78 35.33,14.09 36,15.29 36.74,15.56 36.62,14.84 36.75,14.12 36.74,16.27 36.34,16.87 36.74,17.57 35.94,17.46 36.04,18.16 36.74,18.46 14.08,12.1 15.4,5.09 16.1,5.05 15.83,5.64 16.55,5.88 17.72,5.44 17.31,5.93 16.87,5.32
  pour Top (no thermals): 32.2,13.7 32.2,11.66 32.32,11.54 33.18,11.54 33.4,11.76 33.4,12.56 33.6,12.76 33.9,12.76 34.4,13.26 34.4,13.56 34.63,13.79 37.13,13.79 37.13,18.84 35.91,18.84 35.43,18.37 35.43,16.99
  pour Top (no thermals): 13.53,13.71 13.53,11.67 13.65,11.55 14.51,11.55 14.73,11.78 14.73,12.57 14.93,12.78 15.23,12.78 15.73,13.28 15.73,13.57 15.96,13.8 18.26,13.8 18.26,18.86 17.2,18.86 16.79,18.45 16.79,16.96
  pour Route15 (rank 3, no thermals): 37.4,-1.64 0,-1.64 0,22.96 37.4,22.96
  pour Bottom (no thermals): 17,18.96 18.3,18.96 18.3,14.21 18.92,13.58 23.28,13.58 27.16,9.71 32.74,9.71 33.2,10.16 33.2,16.16 35.9,18.87 37.4,18.87 37.4,-1.64 14.6,-1.64 14.6,10.66 13.9,11.37 13.9,15.87
  pour Top (no thermals): 15.14,3.31 16.41,3.31 17.05,3.95 18.19,3.95 18.32,4.07 18.32,5.6 17.62,6.29 15.71,6.29 14.89,5.47 14.89,3.56
  pour Top (no thermals): 9.89,4.07 11.46,4.07 12.23,3.31 13.12,3.31 13.26,3.45 13.26,5.7 12.73,6.23 10.81,6.23 9.74,5.16 9.74,4.22
  pour Top (no thermals): 2.86,2.84 3.37,2.84 3.45,2.76 3.45,0.46 3.12,0.14 0.28,0.14 -0.1,0.52 -0.1,2.29 2.32,2.29